# Altium schematic sheet buoys_sch_v2.SchDoc
size A4
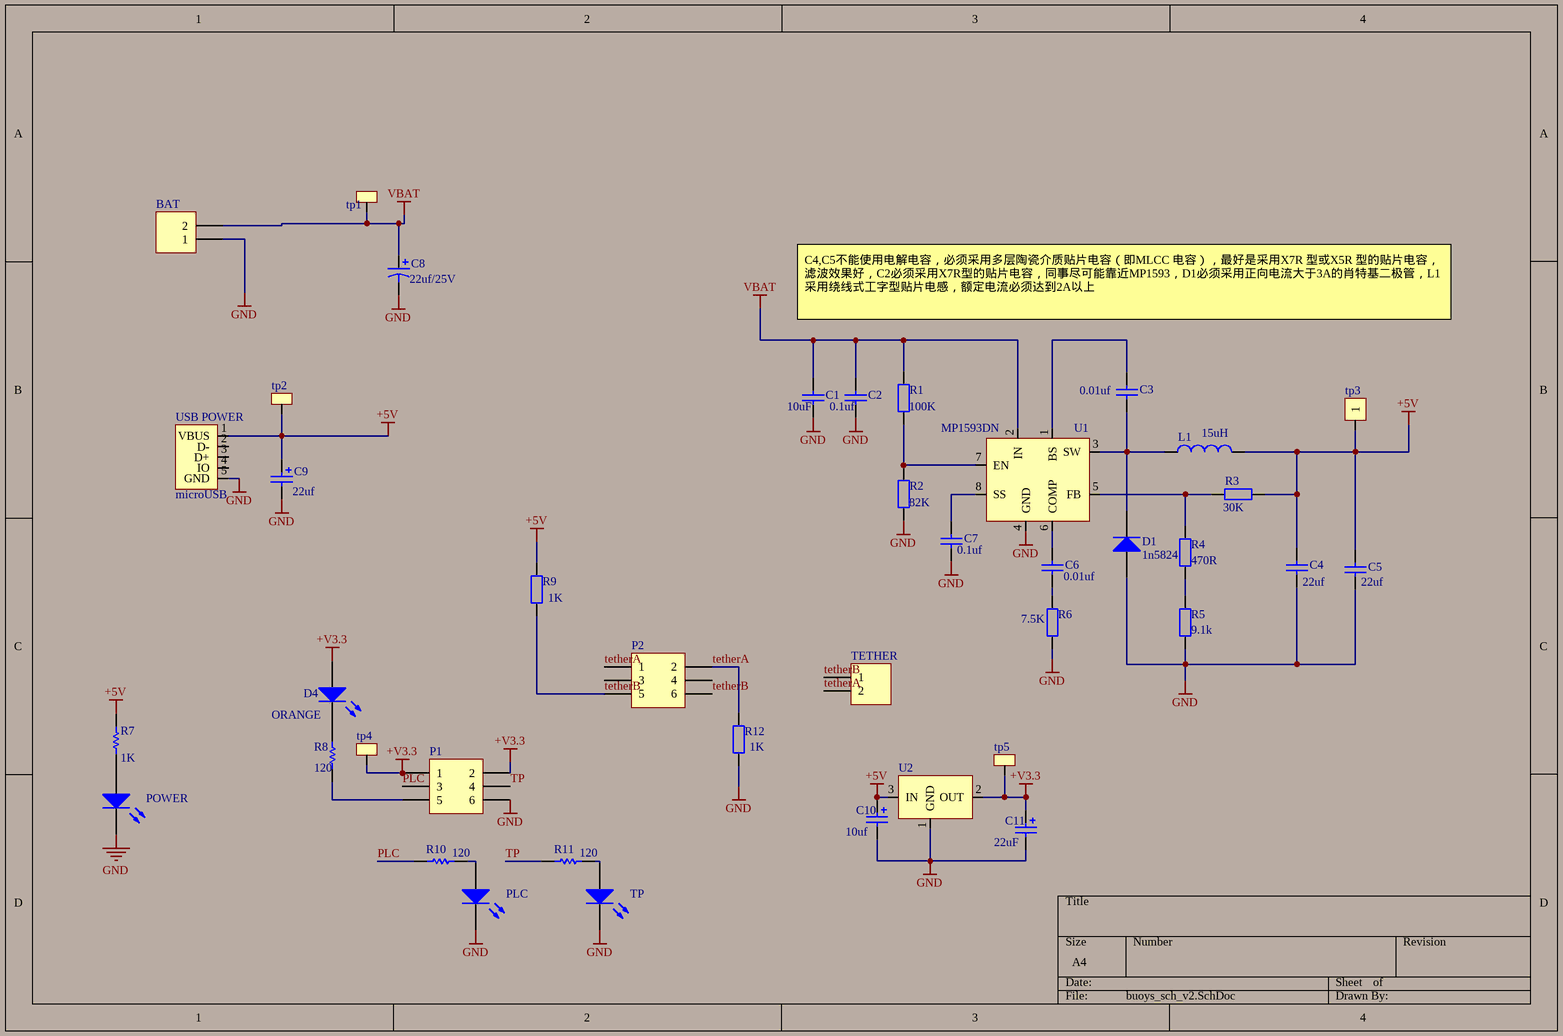
[diagram p0: buoys_sch_v2.SchDoc]

## Parts
BAT  Header 2  [ConnectorBlue]  (value not drawn)
C1  value 10uF  [C1206]  (hidden comment: Cap)
C2  value 0.1uf  [6-0805_M]  (hidden comment: Cap)
C3  value 0.01uf  [0603]  (hidden comment: Cap)
C4  value 22uf  [C1206]  (hidden comment: Cap)
C5  value 22uf  [C1206]  (hidden comment: Cap)
C6  value 0.01uf  [0603]  (hidden comment: Cap)
C7  value 0.1uf  [6-0805_M]  (hidden comment: Cap)
C8  value 22uf/25V  [220UF-35V]  (hidden comment: Cap Pol1)
C9  value 22uf  [C1206]  (hidden comment: Cap Pol2)
C10  value 10uf  [1206]  (hidden comment: Cap Pol2)
C11  value 22uF  [0603]  (hidden comment: Cap Pol2)
D1  1n5824  [1n5824_1]
D4  ORANGE  [6-0805_M]
L1  value 15uH  [0630]  (hidden comment: Inductor)
P1  Header 3X2  [HDR2X3]  (value not drawn)
P2  Header 3X2  [HDR2X3]  (value not drawn)
PLC  RED  [6-0805_M]  (value not drawn)
POWER  RED POWER  [6-0805_M]  (value not drawn)
R1  value 100K  [6-0805_M]  (hidden comment: Res2)
R2  value 82K  [6-0805_M]  (hidden comment: Res2)
R3  value 30K  [6-0805_M]  (hidden comment: Res2)
R4  value 470R  [6-0805_M]  (hidden comment: Res2)
R5  value 9.1k  [6-0805_M]  (hidden comment: Res2)
R6  value 7.5K  [6-0805_M]  (hidden comment: Res2)
R7  value 1K  [6-0805_M]  (hidden comment: Res1)
R8  value 120  [6-0805_L]  (hidden comment: Res1)
R9  value 1K  [6-0805_M]  (hidden comment: Res2)
R10  value 120  [6-0805_L]  (hidden comment: Res1)
R11  value 120  [6-0805_L]  (hidden comment: Res1)
R12  value 1K  [6-0805_M]  (hidden comment: Res2)
TETHER  Header 2  [ConnectorBlue]  (value not drawn)
TP  BLUE  [6-0805_M]  (value not drawn)
tp1  testpoint  [tp]  (value not drawn)
tp2  testpoint  [tp]  (value not drawn)
tp3  tp  [testpoint]  (value not drawn)
tp4  testpoint  [tp]  (value not drawn)
tp5  testpoint  [tp]  (value not drawn)
U1  MP1593DN  [SO8_M]
U2  AMS1117-3.3  [SOT223_M]  (value not drawn)
USB_POWER  microUSB  [microUSB]

## Nets
+5V: C4.2 C5.2 C9.1 C10.1 L1.2 R3.1 R7.2 R9.2 tp2.1(TP) tp3.1 U2.3(IN) USB_POWER.1(VBUS)
+V3.3: C11.1 D4.1(A) P1.1 P1.2 tp4.1(TP) tp5.1(TP) U2.2(OUT)
GND: BAT.1 C1.1 C2.1 C4.1 C5.1 C7.1 C8.2 C9.2 C10.2 C11.2 D1.1(A) P1.6 PLC.2(K) POWER.2(K) R2.1 R5.1 R6.1 R12.1 TP.2(K) U1.4(GND) U2.1(GND) USB_POWER.5(GND)
VBAT: BAT.2 C1.2 C2.2 C8.1 R1.2 tp1.1(TP) U1.2(IN)
PLC: P1.3 R10.2
tetherA: P2.1 P2.2 R12.2 TETHER.2
tetherB: P2.5 P2.6 R9.1 TETHER.1
TP: P1.4 R11.2
NetC3_1: C3.1 D1.2(K) L1.1 U1.3(SW)
NetC3_2: C3.2 U1.1(BS)
NetC6_1: C6.1 R6.2
NetC6_2: C6.2 U1.6(COMP)
NetC7_2: C7.2 U1.8(SS)
NetD4_2: D4.2(K) R8.1
NetP1_5: P1.5 R8.2
NetPLC_1: PLC.1(A) R10.1
NetPOWER_1: POWER.1(A) R7.1
NetR1_1: R1.1 R2.2 U1.7(EN)
NetR3_2: R3.2 R4.2 U1.5(FB)
NetR4_1: R4.1 R5.2
NetR11_1: R11.1 TP.1(A)

Not connected (* = marked no-connect by the designer): P2 3 4; USB_POWER 2(D-) 3(D+) 4(IO)

## Notes on the sheet
- C4,C5不能使用电解电容，必须采用多层陶瓷介质贴片电容（即MLCC 电容），最好是采用X7R 型或X5R 型的贴片电容，滤波效果好，C2必须采用X7R型的贴片电容，同事尽可能靠近MP1593，D1必须采用正向电流大于3A的肖特基二极管，L1采用绕线式工字型贴片电感，额定电流必须达到2A以上

## Library data of the parts
BAT TETHER = Header 2: Header, 2-Pin; LatestRevisionDate: 17-Jul-2002; LatestRevisionNote: Re-released for DXP Platform.; Publisher: Altium Limited
C1-C7 = Cap: Capacitor; Published: 8-Jun-2000; LatestRevisionDate: 17-Jul-2002; LatestRevisionNote: Re-released for DXP Platform.; PackageReference: RAD-0.3; Publisher: Altium Limited; PackageDescription: Radial Cap, Thru-Hole; 2 Leads; 0.3 in Pin Spacing
C8 = Cap Pol1: Polarized Capacitor (Radial); Published: 8-Jun-2000; LatestRevisionDate: 17-Jul-2002; LatestRevisionNote: Re-released for DXP Platform.; PackageReference: RB7.6-15; Publisher: Altium Limited; PackageDescription: Polarized Capacitor (Radial); 2 Leads
C9-C11 = Cap Pol2: Polarized Capacitor (Axial); Published: 8-Jun-2000; LatestRevisionDate: 17-Jul-2002; LatestRevisionNote: Re-released for DXP Platform.; PackageReference: POLAR0.8; Publisher: Altium Limited; PackageDescription: Polarized Capacitor; 2 Leads
D1 = Diode: Default Diode; Published: 8-Jun-2000; LatestRevisionDate: 17-Jul-2002; LatestRevisionNote: Re-released for DXP Platform.; PackageVersion: Sep-1996; PackageReference: SMC; Publisher: Altium Limited; PackageDescription: DO-214-AB/SMC; 2 C-Bend Leads; Body 7.9 x 5.9 mm, inc. leads (LxW); Code_JEDEC: DO-214-AB
D4 PLC POWER TP = LED2: Typical RED, GREEN, YELLOW, AMBER GaAs LED; Published: 8-Jun-2000; LatestRevisionDate: 17-Jul-2002; LatestRevisionNote: Re-released for DXP Platform.; PackageVersion: Feb-2002; PackageReference: 3.2X1.6X1.1; Publisher: Altium Limited; PackageDescription: SM LED; 2 Flat Leads
L1 = Inductor: Code_IEC: 1005; Published: 8-Jun-2000; LatestRevisionDate: 29-May-2009; LatestRevisionNote: IPC-7351 Footprint Added.; PackageReference: 0402-A; Publisher: Altium Limited; PackageDescription: Chip Inductor; Code_JEITA: 0402
P1 P2 = Header 3X2: Header, 3-Pin, Dual row; LatestRevisionDate: 17-Jul-2002; LatestRevisionNote: Re-released for DXP Platform.; Publisher: Altium Limited
R1-R6 R9 R12 = Res2: Resistor; Published: 8-Jun-2000; LatestRevisionDate: 17-Jul-2002; LatestRevisionNote: Re-released for DXP Platform.; PackageReference: AXIAL-0.4; Publisher: Altium Limited; PackageDescription: Axial Device, Thru-Hole; 2 Leads; 0.4 in Pin Spacing
R7 R8 R10 R11 = Res1: Resistor; Published: 8-Jun-2000; LatestRevisionDate: 17-Jul-2002; LatestRevisionNote: Re-released for DXP Platform.; PackageReference: AXIAL-0.3; Publisher: Altium Limited; PackageDescription: Axial Device, Thru-Hole; 2 Leads; 0.3 in Pin Spacing
U2 = Component_3
USB_POWER = Component_1